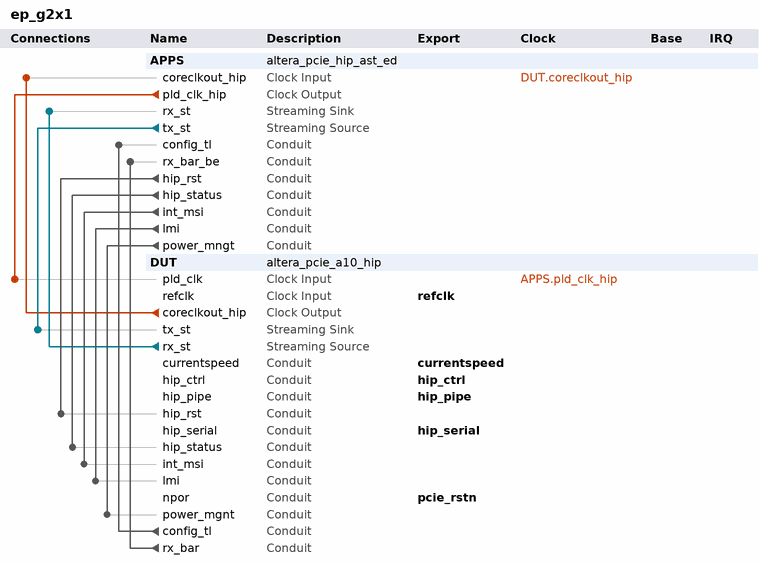
[diagram p0: system contents]
# Platform Designer (Qsys) system ep_g2x1, Arria 10 Unknown
# Parameters at their usual value, and those the tool derives, are not listed.
package require -exact qsys 13.1
create_system ep_g2x1
set_project_property DEVICE_FAMILY {Arria 10}
set_project_property DEVICE Unknown

add_instance APPS altera_pcie_hip_ast_ed 13.1
set_instance_parameter_value APPS device_family_hwtcl {Stratix V}
set_instance_parameter_value APPS lane_mask_hwtcl x1
set_instance_parameter_value APPS gen123_lane_rate_mode_hwtcl {Gen1 (2.5 Gbps)}
set_instance_parameter_value APPS pld_clockrate_hwtcl 125000000
set_instance_parameter_value APPS port_type_hwtcl {Native endpoint}
set_instance_parameter_value APPS ast_width_hwtcl {Avalon-ST 64-bit}
set_instance_parameter_value APPS extend_tag_field_hwtcl 64
set_instance_parameter_value APPS max_payload_size_hwtcl 128
set_instance_parameter_value APPS num_of_func_hwtcl 1
set_instance_parameter_value APPS use_rx_st_be_hwtcl 0
set_instance_parameter_value APPS multiple_packets_per_cycle_hwtcl 0
set_instance_parameter_value APPS track_rxfc_cplbuf_ovf_hwtcl 0
set_instance_parameter_value APPS avalon_waddr_hwltcl 12
set_instance_parameter_value APPS check_bus_master_ena_hwtcl 1
set_instance_parameter_value APPS check_rx_buffer_cpl_hwtcl 1
set_instance_parameter_value APPS use_crc_forwarding_hwtcl 0
set_instance_parameter_value APPS use_ep_simple_downstream_apps_hwtcl 0

add_instance DUT altera_pcie_a10_hip 13.1
set_instance_parameter_value DUT app_interface_width_hwtcl 64-bit
set_instance_parameter_value DUT avmm_addr_width_hwtcl 32
set_instance_parameter_value DUT cg_enable_a2p_interrupt_hwtcl 1
set_instance_parameter_value DUT user_txs_addr_width_hwtcl 32
set_instance_parameter_value DUT cg_a2p_addr_map_pass_thru_bits_hwtcl 20
set_instance_parameter_value DUT lane_rate_hwtcl {Gen2 (5.0 Gbps)}
set_instance_parameter_value DUT link_width_hwtcl x1
set_instance_parameter_value DUT interface_type_hwtcl Avalon-ST
set_instance_parameter_value DUT rx_buffer_credit_alloc_hwtcl Low
set_instance_parameter_value DUT set_pld_clk_x1_625MHz_hwtcl 0
set_instance_parameter_value DUT cseb_config_bypass_hwtcl 0
set_instance_parameter_value DUT bar0_type_hwtcl {64-bit prefetchable memory}
set_instance_parameter_value DUT bar0_address_width_hwtcl 28
set_instance_parameter_value DUT bar1_type_hwtcl Disabled
set_instance_parameter_value DUT bar1_address_width_hwtcl 0
set_instance_parameter_value DUT bar2_address_width_hwtcl 0
set_instance_parameter_value DUT bar3_type_hwtcl Disabled
set_instance_parameter_value DUT bar3_address_width_hwtcl 0
set_instance_parameter_value DUT vendor_id_hwtcl 4466
set_instance_parameter_value DUT device_id_hwtcl 57345
set_instance_parameter_value DUT revision_id_hwtcl 1
set_instance_parameter_value DUT class_code_hwtcl 16711680
set_instance_parameter_value DUT subsystem_vendor_id_hwtcl 19995
set_instance_parameter_value DUT subsystem_device_id_hwtcl 19980
set_instance_parameter_value DUT maximum_payload_size_hwtcl 128
set_instance_parameter_value DUT completion_timeout_hwtcl BCD
set_instance_parameter_value DUT advance_error_reporting_hwtcl 1
set_instance_parameter_value DUT ecrc_check_capable_hwtcl 1
set_instance_parameter_value DUT ecrc_gen_capable_hwtcl 1
set_instance_parameter_value DUT slot_clock_cfg_hwtcl 0
set_instance_parameter_value DUT enable_pipe32_sim_hwtcl 0
set_instance_parameter_value DUT slave_address_map_0_hwtcl 0
set_instance_parameter_value DUT slave_address_map_2_hwtcl 0

# connections
add_connection APPS.pld_clk_hip DUT.pld_clk clock
add_connection DUT.coreclkout_hip APPS.coreclkout_hip clock
add_connection APPS.tx_st DUT.tx_st avalon_streaming
add_connection DUT.rx_st APPS.rx_st avalon_streaming
add_connection APPS.hip_rst DUT.hip_rst conduit
add_connection APPS.hip_status DUT.hip_status conduit
add_connection APPS.int_msi DUT.int_msi conduit
add_connection APPS.lmi DUT.lmi conduit
add_connection APPS.power_mngt DUT.power_mgnt conduit
add_connection DUT.config_tl APPS.config_tl conduit
add_connection DUT.rx_bar APPS.rx_bar_be conduit

# exported interfaces
add_interface refclk clock sink
set_interface_property refclk EXPORT_OF DUT.refclk
add_interface pcie_rstn conduit end
set_interface_property pcie_rstn EXPORT_OF DUT.npor
add_interface hip_ctrl conduit end
set_interface_property hip_ctrl EXPORT_OF DUT.hip_ctrl
add_interface currentspeed conduit end
set_interface_property currentspeed EXPORT_OF DUT.currentspeed
add_interface hip_pipe conduit end
set_interface_property hip_pipe EXPORT_OF DUT.hip_pipe
add_interface hip_serial conduit end
set_interface_property hip_serial EXPORT_OF DUT.hip_serial

set_interconnect_requirement {$system} qsys_mm.clockCrossingAdapter HANDSHAKE
set_interconnect_requirement {$system} qsys_mm.maxAdditionalLatency 0

save_system ep_g2x1.qsys
